# EAGLE design SOIC+TSSOP-20 600mil DIP (EAGLE 6.6.0)
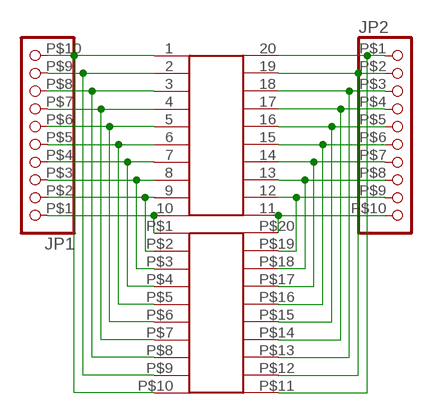
[diagram p0: schematic, sheet 1]

## Parts
JP1  PINHD-1X10THIN  [HEADER1X10]
JP2  PINHD-1X10THIN  [HEADER1X10]
U$1  SMD-20TSSOP  [TSSOP-20NM]
U$2  SMD-20SOIC  [SO-20NMW]

## Nets
N$1: JP1.P$10 U$1.1 U$2.P$10
N$2: JP1.P$9 U$1.2 U$2.P$9
N$3: JP1.P$8 U$1.3 U$2.P$8
N$4: JP1.P$7 U$1.4 U$2.P$7
N$5: JP1.P$6 U$1.5 U$2.P$6
N$6: JP1.P$5 U$1.6 U$2.P$5
N$7: JP1.P$4 U$1.7 U$2.P$4
N$8: JP1.P$3 U$1.8 U$2.P$3
N$9: JP1.P$2 U$1.9 U$2.P$2
N$10: JP1.P$1 U$1.10 U$2.P$1
N$11: JP2.P$1 U$1.20 U$2.P$11
N$12: JP2.P$2 U$1.19 U$2.P$12
N$13: JP2.P$3 U$1.18 U$2.P$13
N$14: JP2.P$5 U$1.16 U$2.P$15
N$15: JP2.P$4 U$1.17 U$2.P$14
N$16: JP2.P$6 U$1.15 U$2.P$16
N$17: JP2.P$7 U$1.14 U$2.P$17
N$18: JP2.P$8 U$1.13 U$2.P$18
N$19: JP2.P$9 U$1.12 U$2.P$19
N$20: JP2.P$10 U$1.11 U$2.P$20

## Library data of the parts
JP1 JP2 = boogie:PINHD-1X10: PIN HEADER
U$1 U$2 = boogie:SMD-20

## Board
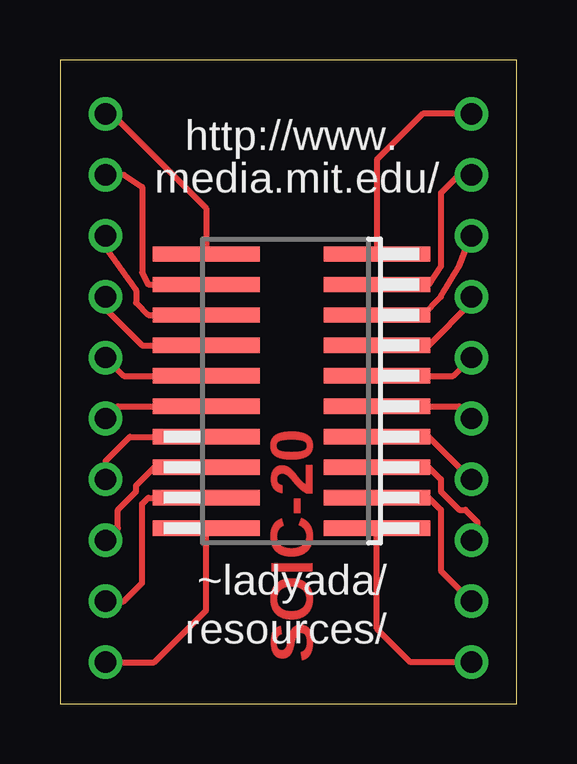
[diagram p1: board, top side]
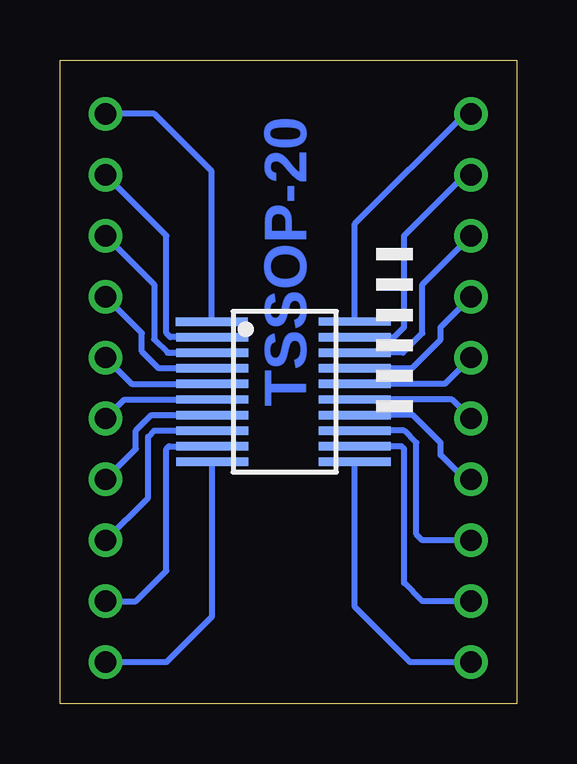
[diagram p2: board, bottom side, seen from below]

Size 19.03 x 26.85 mm. Coordinates in mm from the lower left corner, seen from the top.
Outline: 0,0 19.03,0 19.03,26.85 0,26.85 0,0
Copper layers (1*16): Top 0.035mm / dielectric 1.5mm / Bottom 0.035mm
Design rules "default": minimum track width 10mil, minimum drill 24mil, track to track 10mil, track to pad 10mil, pad to pad 10mil, via to via 10mil, smd to smd 8mil, copper to edge 40mil, drill to drill 8mil, minimum pad ring 10mil, minimum via ring 8mil, stop-mask expansion 4mil, vias tented up to drill 0mil, thermal gap 10mil

### Footprints (pad centres in the part's own frame; a part is rotated, then mirrored left to right if it is on the bottom)
HEADER1X10 = drill 0.889: P$1 11.43,0; P$2 8.89,0; P$3 6.35,0; P$4 3.81,0; P$5 1.27,0; P$6 -1.27,0; P$7 -3.81,0; P$8 -6.35,0; P$9 -8.89,0; P$10 -11.43,0
TSSOP-20NM = smd 0.35 x 3: 1 -1.745,-3.193; 2 -1.105,-3.169; 3 -0.455,-3.169; 4 0.195,-3.169; 5 0.845,-3.169; 6 1.495,-3.169; 7 2.145,-3.169; 8 2.795,-3.169; 9 3.445,-3.169; 10 4.095,-3.169; 11 4.095,2.781; 12 3.445,2.781; 13 2.795,2.781; 14 2.145,2.781; 15 1.495,2.781; 16 0.845,2.781; 17 0.195,2.781; 18 -0.455,2.781; 19 -1.105,2.781; 20 -1.755,2.781
SO-20NMW = smd 0.635 x 4.445: P$1 -4.318,-3.683; P$2 -3.048,-3.683; P$3 -1.778,-3.683; P$4 -0.508,-3.683; P$5 0.762,-3.683; P$6 2.032,-3.683; P$7 3.302,-3.683; P$8 4.572,-3.683; P$9 5.842,-3.683; P$10 7.112,-3.683; P$11 7.112,3.429; P$12 5.842,3.429; P$13 4.572,3.429; P$14 3.302,3.429; P$15 2.032,3.429; P$16 0.762,3.429; P$17 -0.508,3.429; P$18 -1.778,3.429; P$19 -3.048,3.429; P$20 -4.318,3.429

### Placement (x,y rotation side)
JP1  17.14,13.17 270 top
JP2  1.9,13.17 90 top
U$1  9.52,14.19 270 bottom
U$2  9.52,11.65 90 top

### Tracks (layer width: path | path; a pad name or v marks a point on that pad's centre or on a via)
N$1
  Top 0.254: U$2.P$10 13.2,22.7 15.11,24.6 JP1.P$10
  Bottom 0.254: U$1.1 12.71,22.2 15.11,24.6 JP1.P$10
N$2
  Top 0.254: U$2.P$9 15.36,17.49 15.87,18.25 15.87,21.3 16.63,22.06 JP1.P$9
  Bottom 0.254: U$1.2 14.43,15.29 14.6,15.46 14.6,19.52 JP1.P$9
N$3
  Top 0.254: U$2.P$8 15.11,16.22 15.87,16.98 16.63,18.25 JP1.P$8
  Bottom 0.254: U$1.3 14.55,14.64 15.11,15.2 15.11,17.49 JP1.P$8
N$4
  Top 0.254: JP1.P$7 17.14,16.73 15.36,14.95 U$2.P$7
  Bottom 0.254: U$1.4 14.91,13.99 15.62,14.69 15.62,15.46 JP1.P$7
N$5
  Top 0.254: U$2.P$6 16.38,13.68 JP1.P$6
  Bottom 0.254: U$1.5 16.04,13.34 JP1.P$6
N$6
  Top 0.254: U$2.P$5 16.63,12.41 JP1.P$5
  Bottom 0.254: U$1.6 16.35,12.69 JP1.P$5
N$7
  Top 0.254: U$2.P$4 15.36,11.14 JP1.P$4
  Bottom 0.254: U$1.7 15.22,12.04 15.87,11.39 15.87,10.63 JP1.P$4
N$8
  Top 0.254: U$2.P$3 15.36,9.87 15.87,9.36 15.87,8.85 16.63,8.09 16.89,8.09 17.39,7.58 17.39,7.33 17.14,7.07 JP1.P$3
  Bottom 0.254: U$1.8 15.11,11.39 15.36,11.14 15.36,8.6 JP1.P$3
N$9
  Top 0.254: U$2.P$2 15.36,8.6 15.87,8.09 15.87,5.55 JP1.P$2
  Bottom 0.254: U$1.9 14.49,10.74 14.6,10.63 14.6,5.55 15.87,4.28 16.89,4.28 17.14,4.53 JP1.P$2
N$10
  Top 0.254: U$2.P$1 13.2,3.14 14.6,1.74 JP1.P$1
  Bottom 0.254: U$1.10 12.69,3.65 14.6,1.74 JP1.P$1
N$11
  Top 0.254: JP2.P$1 2.15,24.6 6.09,20.66 U$2.P$11
  Bottom 0.254: U$1.20 6.74,20.02 2.15,24.6 JP2.P$1
N$12
  Top 0.254: U$2.P$12 3.68,17.49 3.42,18 3.42,21.55 2.66,22.06 JP2.P$2
  Bottom 0.254: U$1.19 5.11,15.29 4.69,15.71 4.69,19.52 2.15,22.06 JP2.P$2
N$13
  Top 0.254: U$2.P$13 3.68,16.22 3.17,16.73 3.17,17.23 1.9,19.01 JP2.P$3 1.9,19.77
  Bottom 0.254: U$1.18 4.75,14.64 3.93,15.46 3.93,17.49 JP2.P$3
N$14
  Top 0.254: U$2.P$15 2.66,13.68 JP2.P$5
  Bottom 0.254: U$1.16 3,13.34 JP2.P$5
N$15
  Top 0.254: JP2.P$4 1.9,16.47 3.42,14.95 U$2.P$14
  Bottom 0.254: U$1.17 4.38,13.99 3.17,15.2 3.17,15.71 JP2.P$4
N$16
  Top 0.254: U$2.P$16 2.41,12.41 JP2.P$6
  Bottom 0.254: U$1.15 2.69,12.69 JP2.P$6
N$17
  Top 0.254: U$2.P$17 2.92,11.14 1.9,10.12 JP2.P$7
  Bottom 0.254: U$1.14 4.33,12.04 3.17,10.88 3.17,10.38 2.15,9.36 JP2.P$7
N$18
  Top 0.254: U$2.P$18 3.93,9.87 3.17,9.11 3.17,8.85 2.41,8.09 2.41,7.33 JP2.P$8
  Bottom 0.254: U$1.13 4.69,11.39 4.19,10.88 4.19,7.07 3.93,6.82 JP2.P$8
N$19
  Top 0.254: U$2.P$19 3.68,8.6 3.42,8.34 3.42,5.04 2.66,4.28 JP2.P$9
  Bottom 0.254: U$1.12 4.81,10.74 4.69,10.63 4.69,5.04 3.93,4.28 JP2.P$9 1.65,4.28
N$20
  Top 0.254: U$2.P$20 6.09,3.9 3.93,1.74 JP2.P$10 1.65,1.74
  Bottom 0.254: U$1.11 6.74,4.04 4.44,1.74 JP2.P$10

### Text on the board
Top: SOIC-20
Bottom: TSSOP-20
tPlace: http://www. | media.mit.edu/ | ~ladyada/ | resources/